# EAGLE design Tiny Programmer_PB (EAGLE 6.1)
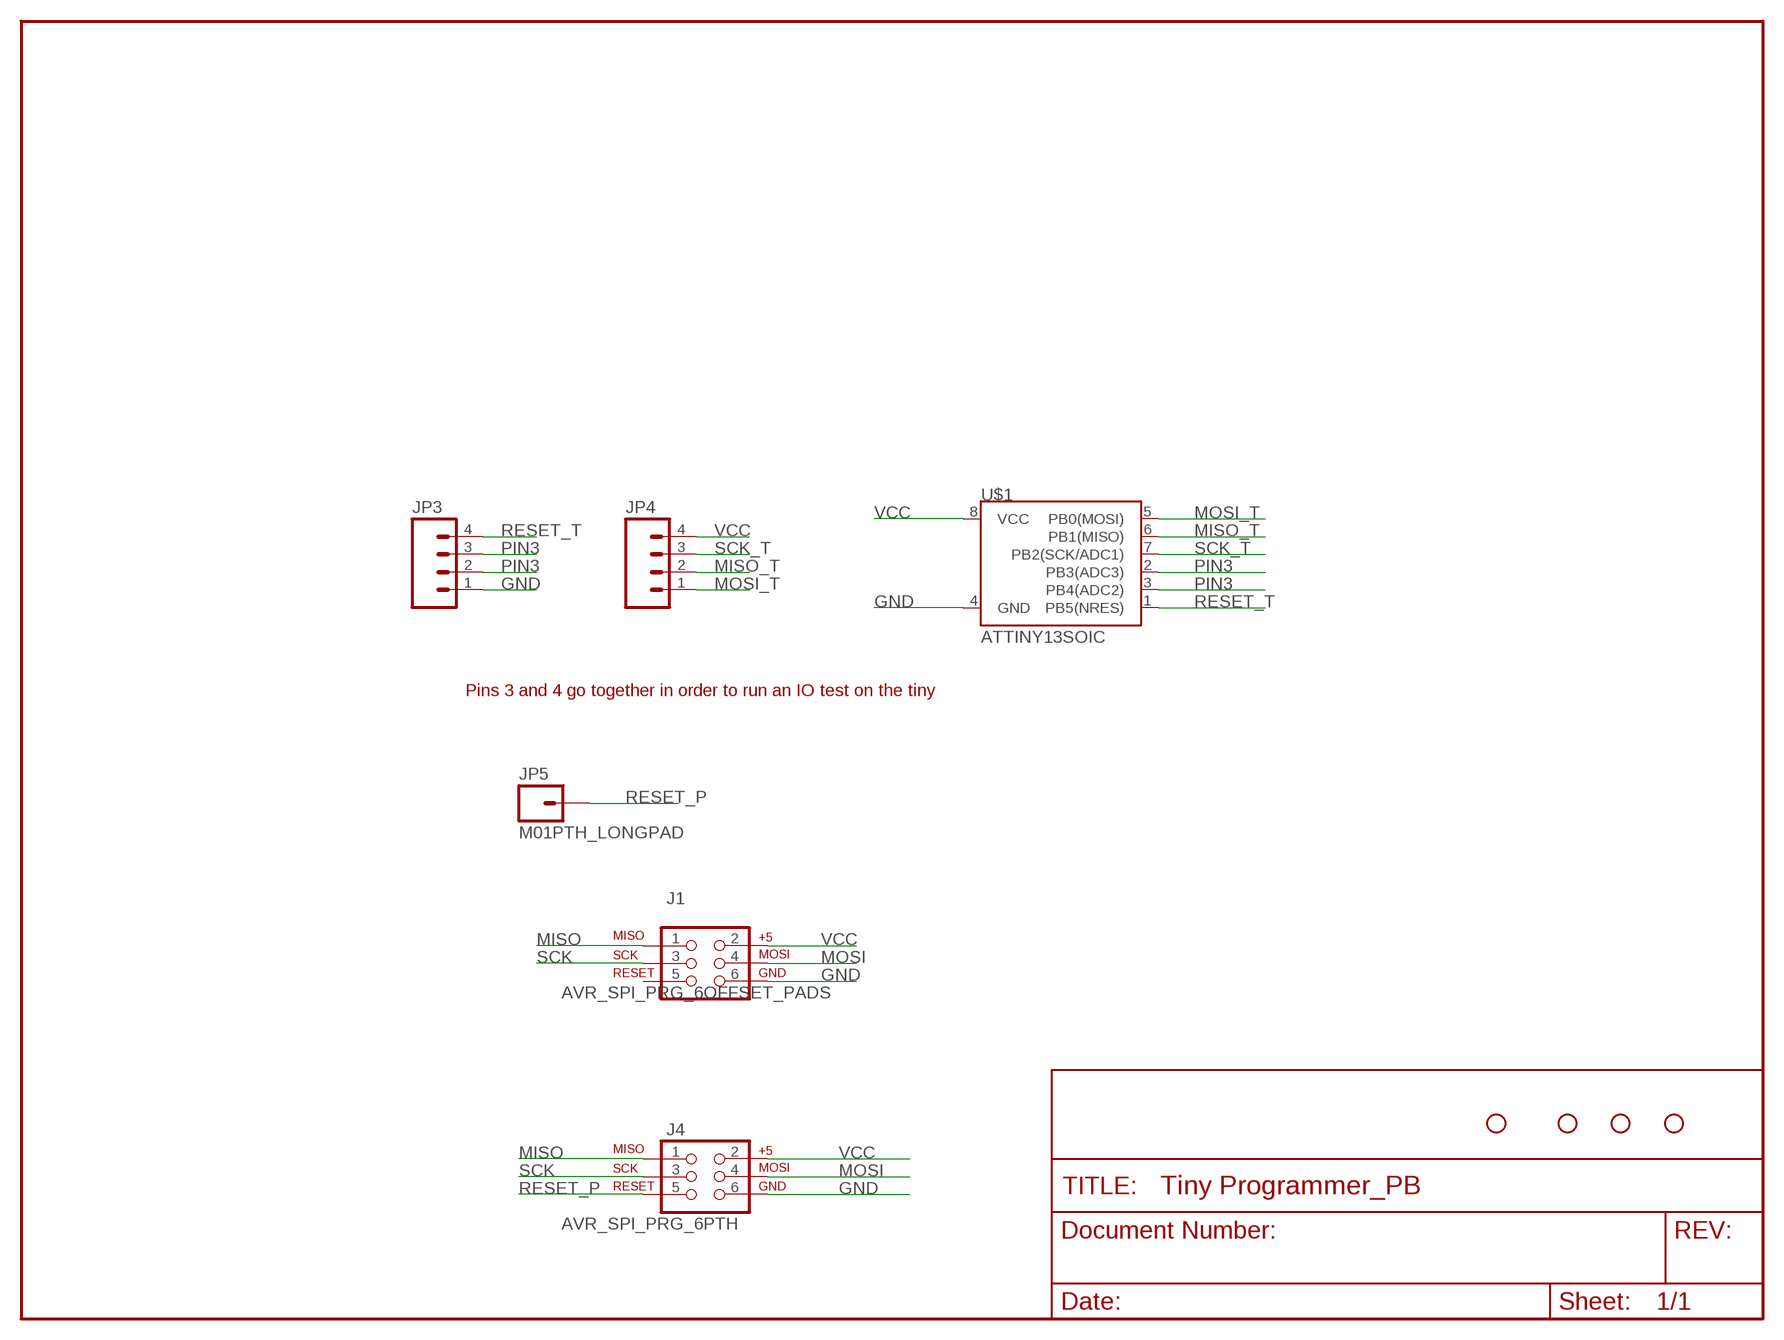
[diagram p0: schematic, sheet 1]

## Parts
J1  AVR_SPI_PRG_6OFFSET_PADS  [2X3_OFFSET]
J4  AVR_SPI_PRG_6PTH  [2X3]
JP1  STAND-OFFTIGHTER  [STAND-OFF-TIGHTER]
JP2  STAND-OFFTIGHTER  [STAND-OFF-TIGHTER]
JP3  M04LONGPADS  [1X04_LONGPADS]
JP4  M04LONGPADS  [1X04_LONGPADS]
JP5  M01PTH_LONGPAD  [1X01_LONGPAD]
JP8  STAND-OFFTIGHTER  [STAND-OFF-TIGHTER]
JP9  STAND-OFFTIGHTER  [STAND-OFF-TIGHTER]
U$1  ATTINY13SOIC  [SO08]

## Nets
GND: J1.6 J4.6 JP3.1 U$1.4(GND)
MISO: J1.1 J4.1
MISO_T: JP4.2 U$1.6(PB1(MISO))
MOSI: J1.4 J4.4
MOSI_T: JP4.1 U$1.5(PB0(MOSI))
PIN3: JP3.2 JP3.3 U$1.2(PB3(ADC3)) U$1.3(PB4(ADC2))
RESET_P: J4.5 JP5.1
RESET_T: JP3.4 U$1.1(PB5(NRES))
SCK: J1.3 J4.3
SCK_T: JP4.3 U$1.7(PB2(SCK/ADC1))
VCC: J1.2 J4.2 JP4.4 U$1.8(VCC)
Unconnected: J1.5

## Notes on the sheet
- Pins 3 and 4 go together in order to run an IO test on the tiny

## Library data of the parts
J1 J4 = SparkFun:AVR_SPI_PRG_6: AVR ISP 6 Pin This is the reduced ISP connector for AVR programming. Common on Arduino. This footprint will take up less PCB space and can be used with a 10-pin to 6-pin adapter such as SKU: BOB-08508
JP1 JP2 JP8 JP9 = Testing:STAND-OFF: Stand Off This is the mechanical footprint for a #4 phillips button head screw. Use the keepout ring to avoid running the screw head into surrounding components. SKU : PRT-00447
JP3 JP4 = SparkFun:M04: Header 4 Standard 4-pin 0.1" header. Use with straight break away headers (SKU : PRT-00116), right angle break away headers (PRT-00553), swiss pins (PRT-00743), machine pins (PRT-00117), and female headers (PRT-00115). Molex polarized connector foot print use with SKU : PRT-08231 with associated crimp pins and housings. 1MM SMD Version SKU: PRT-10208
JP5 = SparkFun:M01: Header 1 Standard 1-pin 0.1" header. Use with straight break away headers (SKU : PRT-00116), right angle break away headers (PRT-00553), swiss pins (PRT-00743), machine pins (PRT-00117), and female headers (PRT-00115).
U$1 = SparkFun:ATTINY13

## Net classes
1 BIG: width 0.762 mm, clearance 0.305 mm to class 0, clearance 0.305 mm

## Board
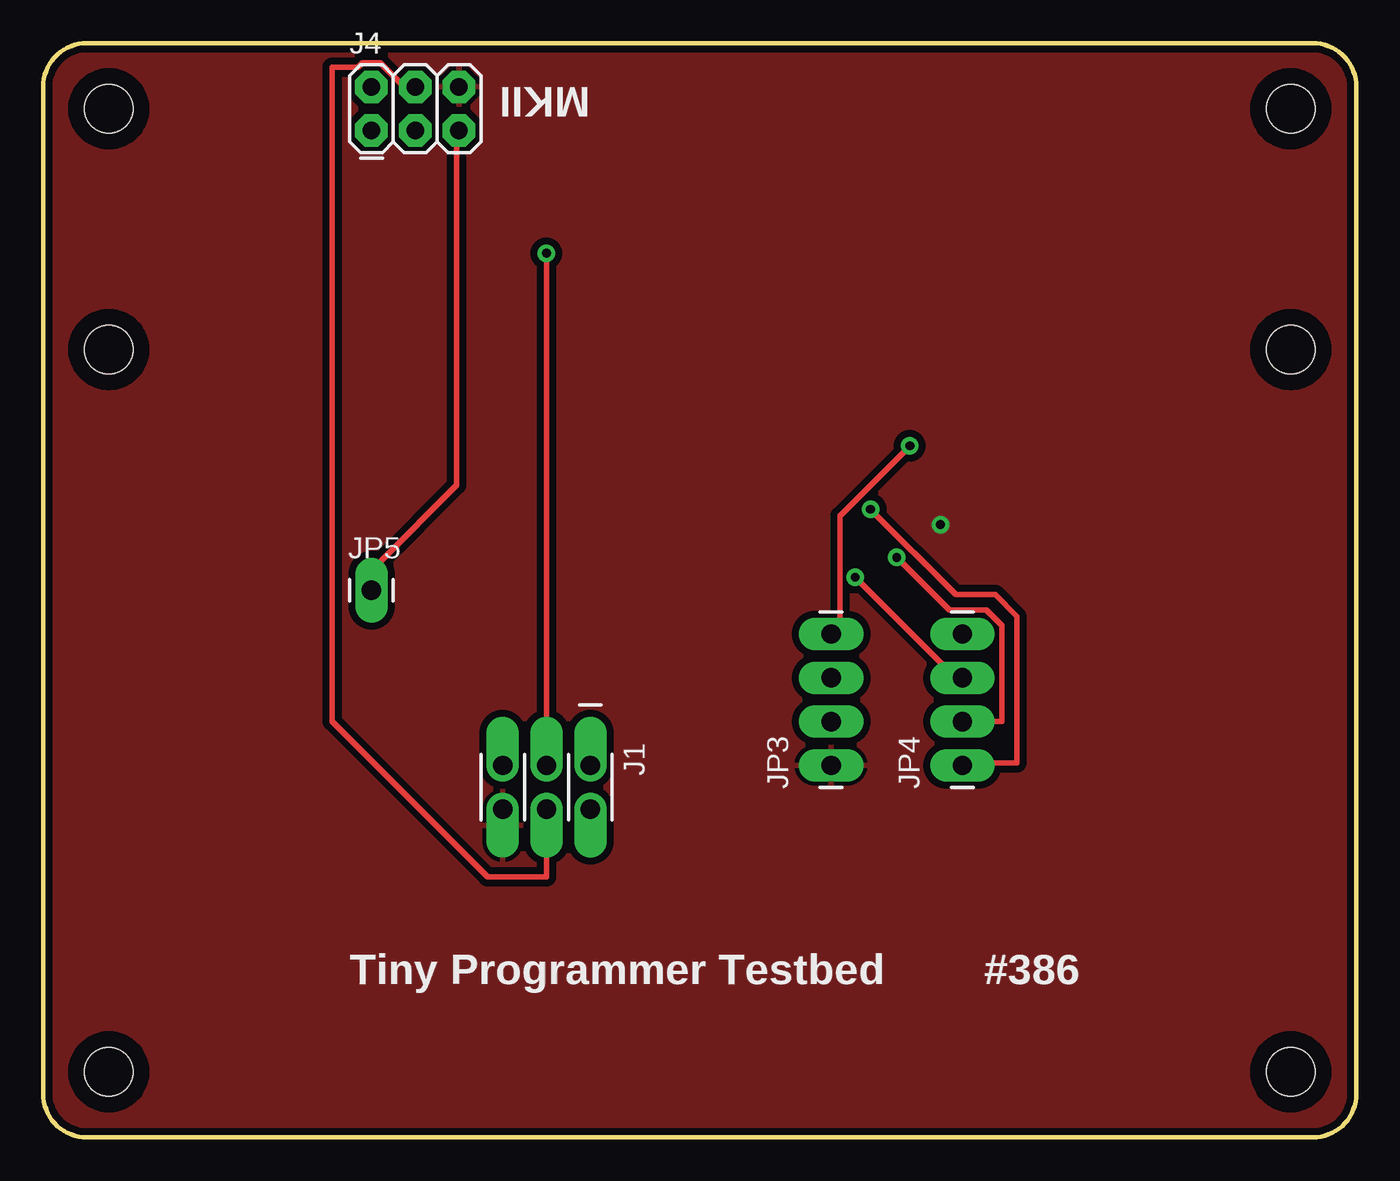
[diagram p1: board, top side]
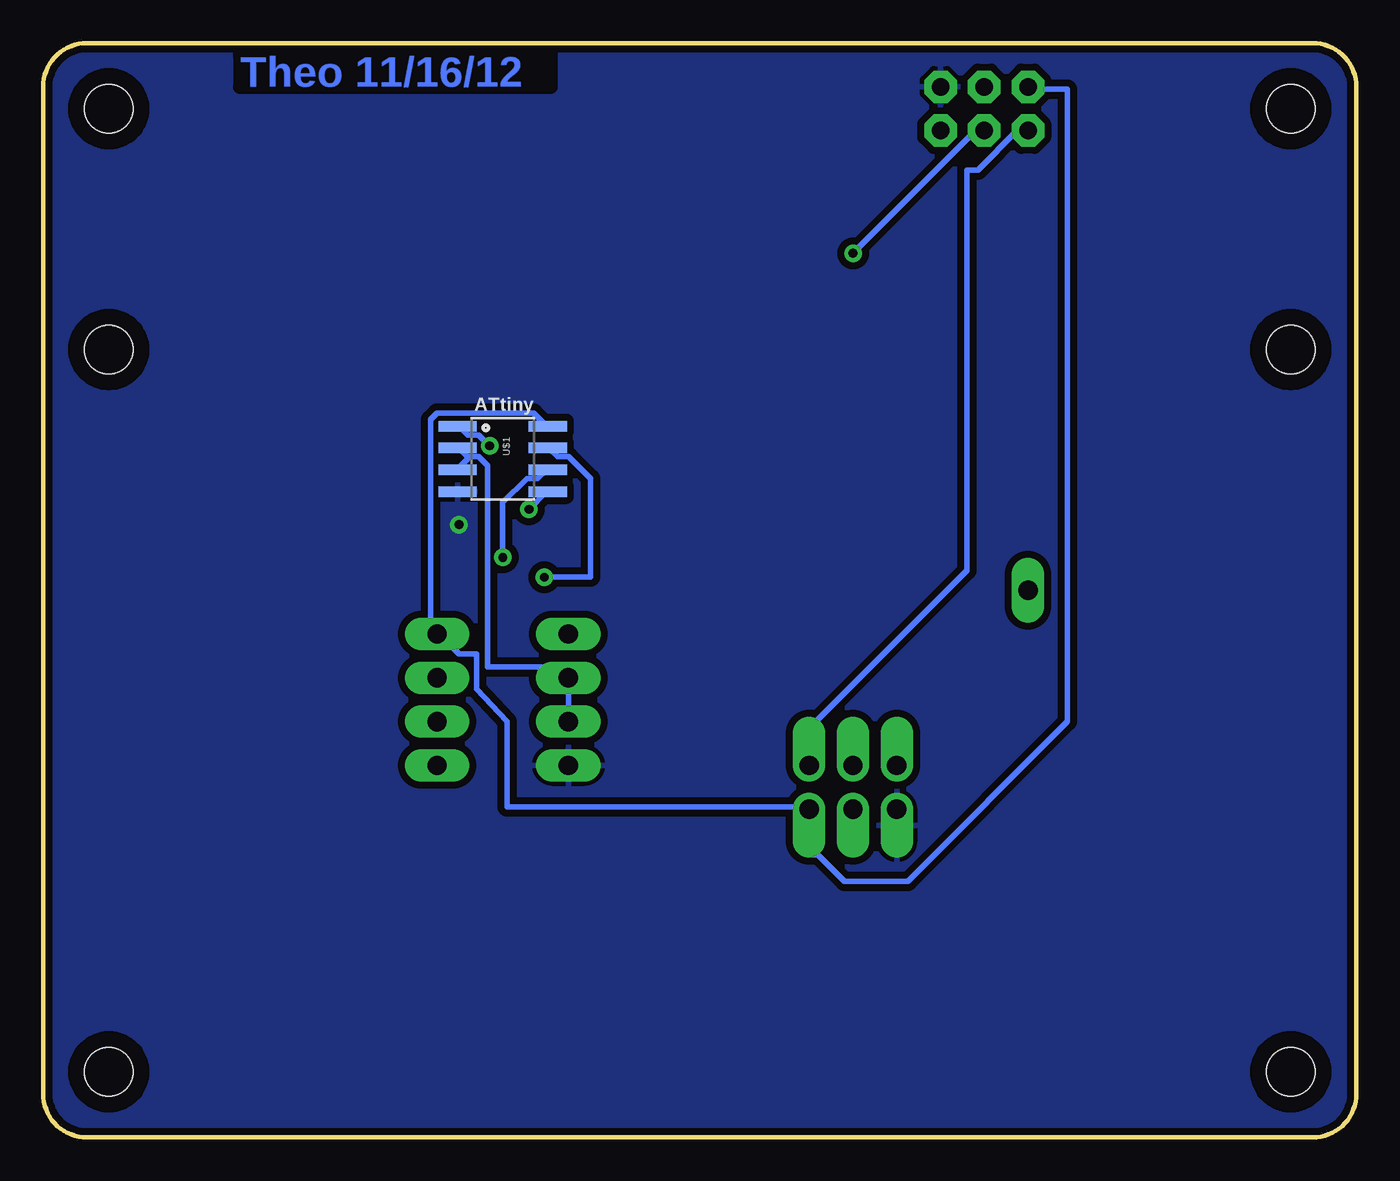
[diagram p2: board, bottom side, seen from below]

Size 76.2 x 63.5 mm. Coordinates in mm from the lower left corner, seen from the top.
Outline: 2.54,0 arc-90 0,2.54 0,60.96 arc-90 2.54,63.5 73.66,63.5 arc-90 76.2,60.96 76.2,2.54 arc-90 73.66,0 2.54,0
Copper layers (1*16): Top 0.035mm / dielectric 1.5mm / Bottom 0.035mm
Design rules: minimum track width 8mil, minimum drill 20mil, track to track 8mil, track to pad 8mil, pad to pad 8mil, via to via 8mil, smd to smd 8mil, copper to edge 8mil, drill to drill 8mil, minimum pad ring 12mil, minimum via ring 10mil, stop-mask expansion 4mil, vias tented up to drill 20mil, thermal gap 10mil

### Footprints (pad centres in the part's own frame; a part is rotated, then mirrored left to right if it is on the bottom)
2X3_OFFSET = drill 1.118 pad 1.88 offset: 1 -2.54,-1.27; 2 -2.54,1.27; 3 0,-1.27; 4 0,1.27; 5 2.54,-1.27; 6 2.54,1.27
2X3 = drill 1.016 pad 1.88 octagon: 1 0,0; 2 0,2.54; 3 2.54,0; 4 2.54,2.54; 5 5.08,0; 6 5.08,2.54
STAND-OFF-TIGHTER = hole 2.794: 0,0
1X04_LONGPADS = drill 1.118 pad 1.88 long: 1 0,0; 2 2.54,0; 3 5.08,0; 4 7.62,0
1X01_LONGPAD = drill 1.118 pad 1.88 long: 1 0,0
SO08 = smd 0.61 x 2.21: 1 -1.905,-2.616; 2 -0.635,-2.616; 3 0.635,-2.616; 4 1.905,-2.616; 5 1.905,2.616; 6 0.635,2.616; 7 -0.635,2.616; 8 -1.905,2.616

### Placement (x,y rotation side)
J1  29.21,20.32 180 top
J4  19.05,58.42 0 top
JP1  3.81,45.72 0 top
JP2  72.39,45.72 0 top
JP3  45.72,21.59 90 top
JP4  53.34,21.59 90 top
JP5  19.05,31.75 0 top
JP7  STAND-OFFTIGHTER  [STAND-OFF-TIGHTER]  72.39,59.69 0 top
JP8  3.81,3.81 0 top
JP9  72.39,3.81 0 top
JP10  STAND-OFFTIGHTER  [STAND-OFF-TIGHTER]  3.81,59.69 0 top
U$1  49.53,39.37 270 bottom

### Tracks (layer width: path | path; a pad name or v marks a point on that pad's centre or on a via)
GND  (via drill 0.51)
  other vias: 52.07,35.56
  pour Bottom (isolate 0.406): 0,0 76.2,0 76.2,63.5 0,63.5
  pour Top (isolate 0.406): 0,63.5 0,0 76.2,0 76.2,63.5
MISO
  Bottom 0.305: J1.1 31.75,24.13 31.37,24.13 22.61,32.89 22.61,56.13 21.97,56.13 19.68,58.42 J4.1
MISO_T  (via drill 0.51)
  Top 0.305: v49.53,33.66 52.58,30.61 54.74,30.61 55.63,29.72 55.63,24.13 JP4.2
  Bottom 0.305: v49.53,33.66 49.53,36.83 48.13,38.23 47.5,38.23 46.99,38.73 U$1.6
MOSI
  Top 0.305: J1.4 29.21,15.11 25.78,15.11 16.76,24.13 16.76,62.1 18.29,62.1 18.54,62.36 19.56,62.36 20.95,60.96 J4.4
MOSI_T  (via drill 0.51)
  Top 0.305: v48.01,36.45 52.96,31.5 55.24,31.5 56.52,30.23 56.52,21.72 53.47,21.72 JP4.1
  Bottom 0.305: v48.01,36.45 46.99,37.47 U$1.5
PIN3
  Bottom 0.305: 51.56,39.5 52.07,40.01 U$1.2 | 51.56,39.5 50.93,39.5 50.42,38.99 50.42,27.3 46.35,27.3 JP3.3 JP3.2 | 52.2,38.86 U$1.3 52.07,38.86 51.56,39.37 51.56,39.5
RESET_P
  Top 0.305: JP5.1 19.05,33.4 19.56,33.4 24,37.85 24,58.42 J4.5
RESET_T  (via drill 0.51)
  Top 0.305: v50.29,40.13 46.23,36.07 46.23,29.21 JP3.4
  Bottom 0.305: v50.29,40.13 50.93,40.77 51.56,40.77 52.07,41.27 U$1.1
SCK  (via drill 0.51)
  Top 0.305: v29.21,51.31 J1.3
  Bottom 0.305: v29.21,51.31 22.1,58.42 J4.3
SCK_T  (via drill 0.51)
  Top 0.305: v47.12,32.51 52.96,26.67 JP4.3
  Bottom 0.305: v47.12,32.51 44.45,32.51 44.45,38.23 45.72,39.5 46.35,39.5 46.86,40.01 U$1.7
VCC
  Bottom 0.305: J4.2 18.92,60.83 16.76,60.83 16.76,24.13 26.04,14.86 29.72,14.86 31.24,16.38 31.75,16.38 J1.2 31.75,19.18 49.28,19.18 49.28,24.13 51.05,26.04 51.05,28.07 52.07,28.07 53.21,29.21 JP4.4 53.72,29.21 53.72,41.66 53.34,42.04 47.75,42.04 46.99,41.27 U$1.8

### Text on the board
Bottom: Theo 11/16/12
tPlace: MKII | Tiny Programmer Testbed | #386
bPlace: ATtiny
Reference: + | 3 | 2 | 4 | 1 | - | 0